# EAGLE schematic procesor (EAGLE 9.7.0)
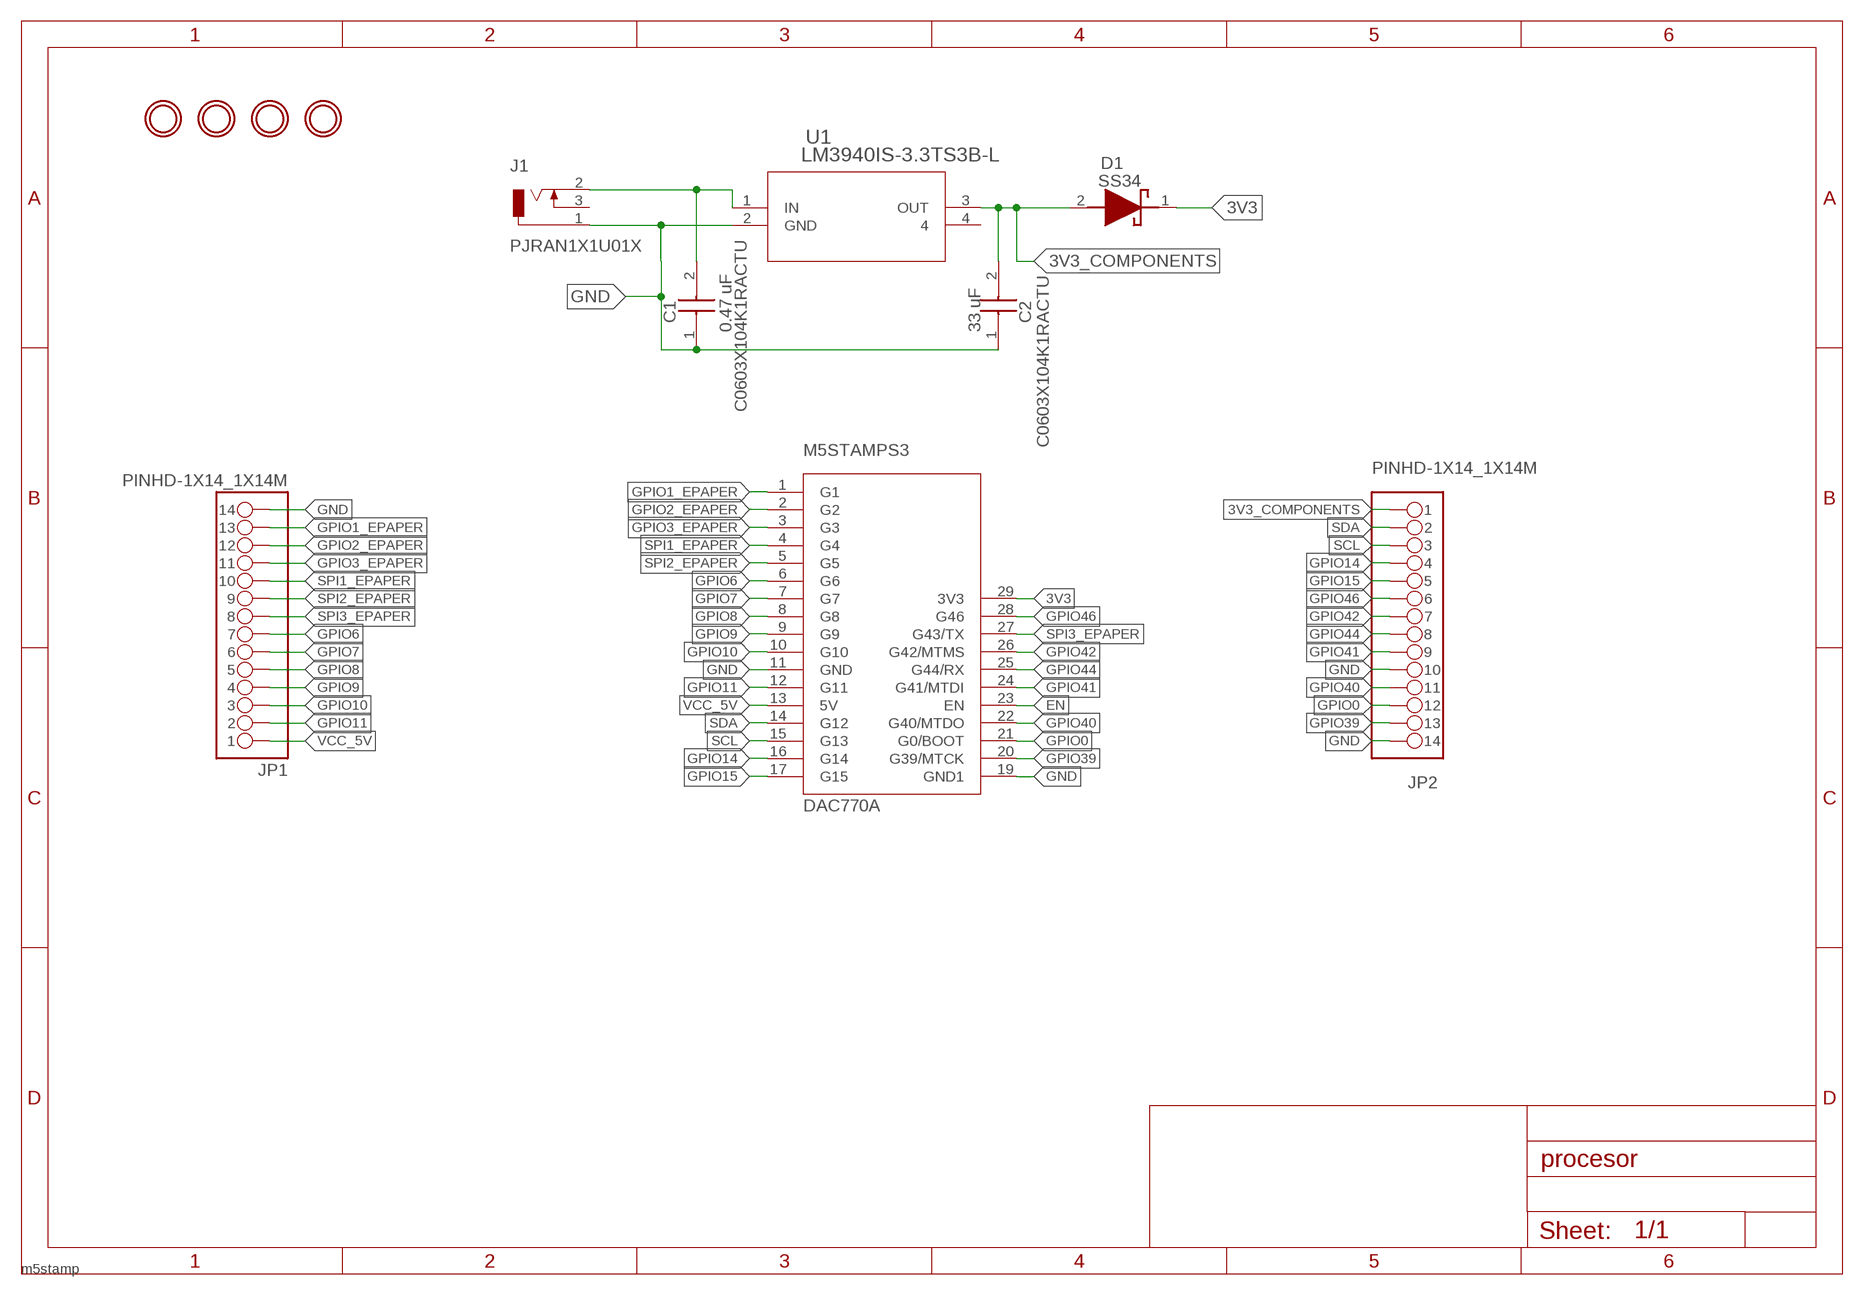
[diagram p0: schematic, sheet 1]
FRAME1 (A4L-LOC): ETYKIETA: m5stamp

## Parts
C1  C0603X104K1RACTU  [CAPC1608X100N]
C2  C0603X104K1RACTU  [CAPC1608X100N]
D1  SS34  [DIOM8059X256N]
J1  PJRAN1X1U01X  [PJRAN1X1U01X]
JP1  PINHD-1X14_1X14M  [1X14]
JP2  PINHD-1X14_1X14M  [1X14]
M5STAMPS3  DAC770A  [QFN127P2400X1800X470-36N]
U1  LM3940IS-3.3TS3B-L  [TS3B-L]
U$1  MOUNTINGHOLE2.5  [MOUNTINGHOLE_2.5_PLATED]
U$3  MOUNTINGHOLE2.5  [MOUNTINGHOLE_2.5_PLATED]
U$5  MOUNTINGHOLE2.5  [MOUNTINGHOLE_2.5_PLATED]
U$6  MOUNTINGHOLE2.5  [MOUNTINGHOLE_2.5_PLATED]

## Nets
3V3 [zasilanie]: D1.1(K) M5STAMPS3.29(3V3)
3V3_COMPONENTS [zasilanie]: C2.2 D1.2(A) JP2.1 U1.3(OUT)
EN: M5STAMPS3.23(EN)
GND [zasilanie]: C1.1 C2.1 J1.1 JP1.14 JP2.10 JP2.14 M5STAMPS3.11(GND) M5STAMPS3.19(GND1) U1.2(GND)
GPIO0: JP2.12 M5STAMPS3.21(G0/BOOT)
GPIO1_EPAPER: JP1.13 M5STAMPS3.1(G1)
GPIO2_EPAPER: JP1.12 M5STAMPS3.2(G2)
GPIO3_EPAPER: JP1.11 M5STAMPS3.3(G3)
GPIO6: JP1.7 M5STAMPS3.6(G6)
GPIO7: JP1.6 M5STAMPS3.7(G7)
GPIO8: JP1.5 M5STAMPS3.8(G8)
GPIO9: JP1.4 M5STAMPS3.9(G9)
GPIO10: JP1.3 M5STAMPS3.10(G10)
GPIO11: JP1.2 M5STAMPS3.12(G11)
GPIO14: JP2.4 M5STAMPS3.16(G14)
GPIO15: JP2.5 M5STAMPS3.17(G15)
GPIO39: JP2.13 M5STAMPS3.20(G39/MTCK)
GPIO40: JP2.11 M5STAMPS3.22(G40/MTDO)
GPIO41: JP2.9 M5STAMPS3.24(G41/MTDI)
GPIO42: JP2.7 M5STAMPS3.26(G42/MTMS)
GPIO44: JP2.8 M5STAMPS3.25(G44/RX)
GPIO46: JP2.6 M5STAMPS3.28(G46)
N$3: C1.2 J1.2 U1.1(IN)
SCL: JP2.3 M5STAMPS3.15(G13)
SDA: JP2.2 M5STAMPS3.14(G12)
SPI1_EPAPER: JP1.10 M5STAMPS3.4(G4)
SPI2_EPAPER: JP1.9 M5STAMPS3.5(G5)
SPI3_EPAPER: JP1.8 M5STAMPS3.27(G43/TX)
VCC_5V [zasilanie]: JP1.1 M5STAMPS3.13(5V)
Unconnected: J1.3 U1.4

## Library data of the parts
C1 = C0603X104K1RACTU:C0603X104K1RACTU: 0.1 F +/-10% 100V Ceramic Capacitor X7R 0603 (1608 Metric) Source: Datasheet <https://search.kemet.com/component-documentation/download/specsheet/C0603X104K1RACTU>; DESCRIPTION: 0.47 uF; HEIGHT: 1mm; MANUFACTURER_NAME: KEMET; MANUFACTURER_PART_NUMBER: C0603X104K1RACTU; MOUSER_PART_NUMBER: 80-C0603X104K1RACTU; MOUSER_PRICE-STOCK: https://www.mouser.co.uk/ProductDetail/KEMET/C0603X104K1RACTU?qs=ZcfC38r4PovU2DcqPY0qJg%3D%3D
C2 = C0603X104K1RACTU:C0603X104K1RACTU: 0.1 F +/-10% 100V Ceramic Capacitor X7R 0603 (1608 Metric) Source: Datasheet <https://search.kemet.com/component-documentation/download/specsheet/C0603X104K1RACTU>; DESCRIPTION: 33 uF; HEIGHT: 1mm; MANUFACTURER_NAME: KEMET; MANUFACTURER_PART_NUMBER: C0603X104K1RACTU; MOUSER_PART_NUMBER: 80-C0603X104K1RACTU; MOUSER_PRICE-STOCK: https://www.mouser.co.uk/ProductDetail/KEMET/C0603X104K1RACTU?qs=ZcfC38r4PovU2DcqPY0qJg%3D%3D
D1 = SamacSys_Parts:SS34: ON Semi SS34 SMT Schottky Diode, 40V 3A, 2-Pin DO-214AB Source: Datasheet <https://componentsearchengine.com/Datasheets/2/SS34.pdf>; DESCRIPTION: ON Semi SS34 SMT Schottky Diode, 40V 3A, 2-Pin DO-214AB; HEIGHT: 2.56mm; MANUFACTURER_NAME: onsemi; MANUFACTURER_PART_NUMBER: SS34; MOUSER_PART_NUMBER: 512-SS34; MOUSER_PRICE-STOCK: https://www.mouser.co.uk/ProductDetail/onsemi-Fairchild/SS34?qs=2ONuHmP%2FXzb3ub11UdFfdQ%3D%3D
J1 = Connector:PJRAN1X1U01X: CONN RCA JACK MONO 3.2MM R/A Manufacturer's datasheet <http://www.switchcraft.com/Drawings/pjran1x1u__x_series_cd.pdf>; CATEGORY: RCA Phono Connectors; DESCRIPTION: RCA Phono Connectors 1 POS R/A PHONO JACK; MANUFACTURER: Switchcraft Inc.; MPN: PJRAN1X1U01X; OPERATING_TEMPERATURE: -25°C ~ 85°C; PART_STATUS: Active; PITCH: -; ROHS_COMPLIANCE: ROHS3 Compliant; SERIES: PJR; SUBCATEGORY: Audio & Video Connectors; TYPE: Phono (RCA) Jack, Female, Through Hole, Right Angle
JP1 JP2 = Tinkercad:PINHD-1X14
M5STAMPS3 = M5STAMPS3:DAC770A
U1 = 2024-06-25_11-20-03_Library:LM3940IS-3.3; COPYRIGHT: Copyright (C) 2024 Ultra Librarian. All rights reserved.; MANUFACTURER_PART_NUMBER: LM3940IS-3.3; MFR_NAME: Texas Instruments; TYPE: LM3940IS-3.3
U$1 U$3 U$5 U$6 = microbuilder:MOUNTINGHOLE: Mounting Hole For #2 screws (0.086"/2.18mm width, 0.094"/2.4mm hole) use 2.5mm; BOM: EXCLUDE

## Net classes
1 zasilanie: width 0.762 mm